# EAGLE design AlimBoard (EAGLE 5.06)
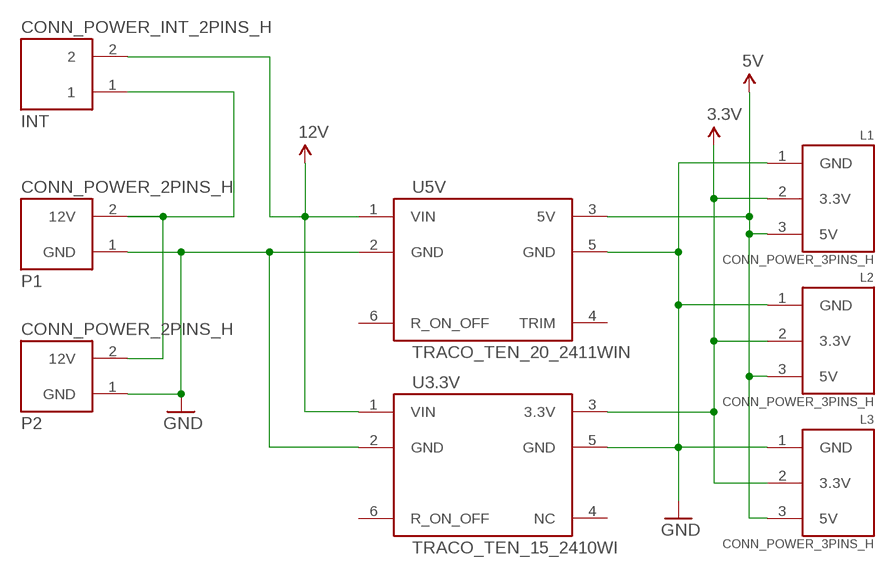
[diagram p0: schematic, sheet 1]

## Parts
INT  CONN_POWER_INT_2PINS_H  [2PINS_5MM_90DEG]
L1  CONN_POWER_3PINS_H  [3PINS_3.81MM_90DEG]
L2  CONN_POWER_3PINS_H  [3PINS_3.81MM_90DEG]
L3  CONN_POWER_3PINS_H  [3PINS_3.81MM_90DEG]
P1  CONN_POWER_2PINS_H  [2PINS_5MM_90DEG]
P2  CONN_POWER_2PINS_H  [2PINS_5MM_90DEG]
U3.3V  TRACO_TEN_15_2410WI  [TRACO_1_PER_2]
U5V  TRACO_TEN_20_2411WIN  [TRACO_1_PER_2]

## Nets
3.3V: L1.2(3.3V) L2.2(3.3V) L3.2(3.3V) U3.3V.3(3.3V)
5V: L1.3(5V) L2.3(5V) L3.3(5V) U5V.3(5V)
12V: INT.2 U3.3V.1(VIN) U5V.1(VIN)
GND: L1.1(GND) L2.1(GND) L3.1(GND) P1.1(GND) P2.1(GND) U3.3V.2(GND) U3.3V.5(GND) U5V.2(GND) U5V.5(GND)
N$1: INT.1 P1.2(12V) P2.2(12V)
Unconnected: U3.3V.4(NC) U3.3V.6(R_ON_OFF) U5V.4(TRIM) U5V.6(R_ON_OFF)

## Library data of the parts
INT = Robot:CONN_POWER_INT_2PINS: CONNECTOR FOR A POWER INTERRUPTER
L1-L3 = Robot:CONN_POWER_3PINS: POWER CONNECTOR for logic boards. Provides 3.3V and 5V.
P1 P2 = Robot:CONN_POWER_2PINS: POWER CONNECTOR for DC/DC converter boards and H-bridge motor controllers.
U3.3V = Robot:TRACO_TEN_15_2410WI: TRACO POWER TEN 15-2410WI DC/DC Converter 15W. Vin: 9-36V, Vout: 3.3V
U5V = Robot:TRACO_TEN_20_2411WIN: TRACO POWER TEN 20-2411WIN DC/DC Converter 20W. Vin: 9-36V, Vout: 5V

## Board
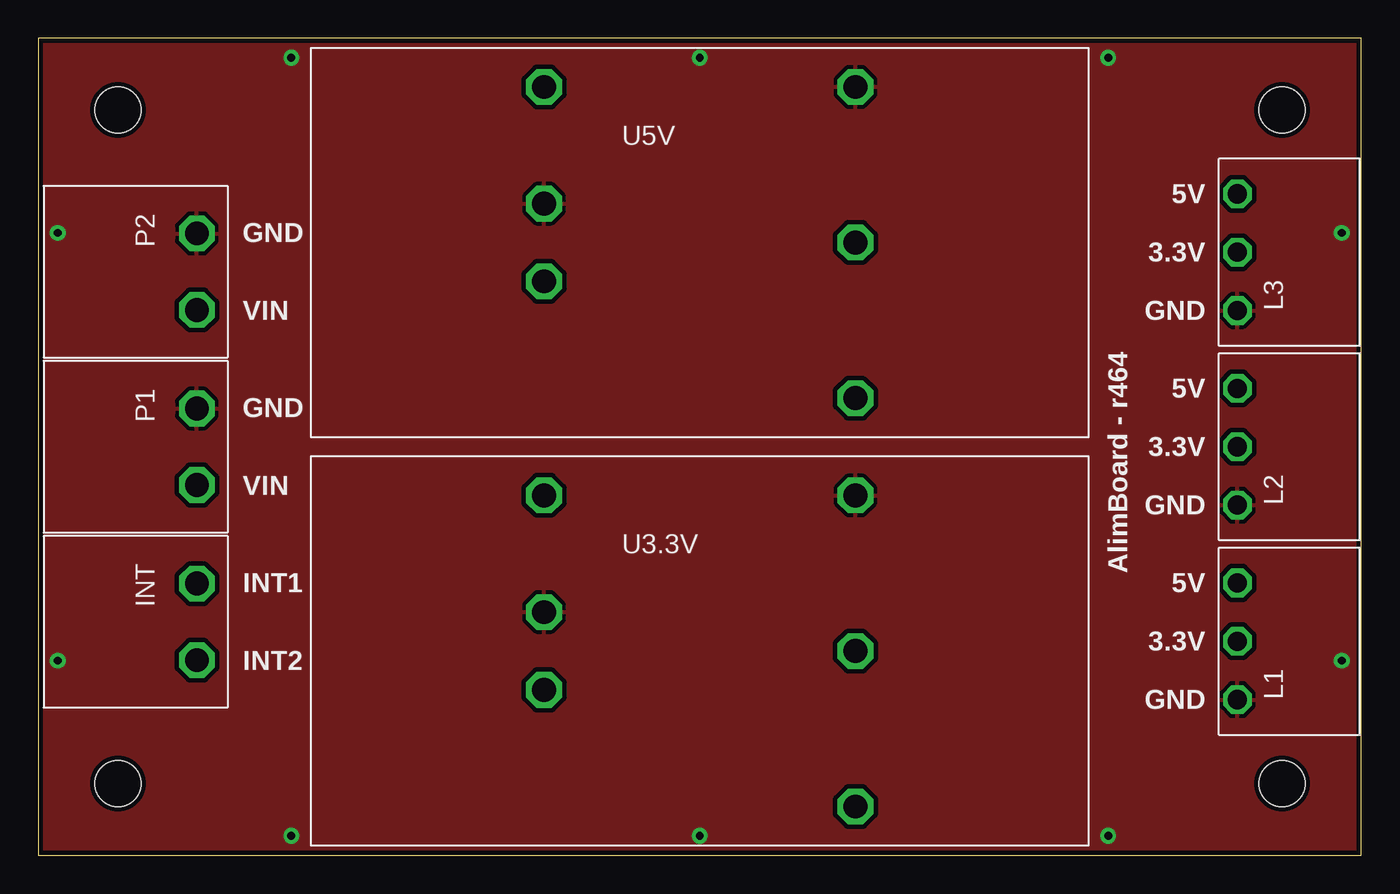
[diagram p1: board, top side]
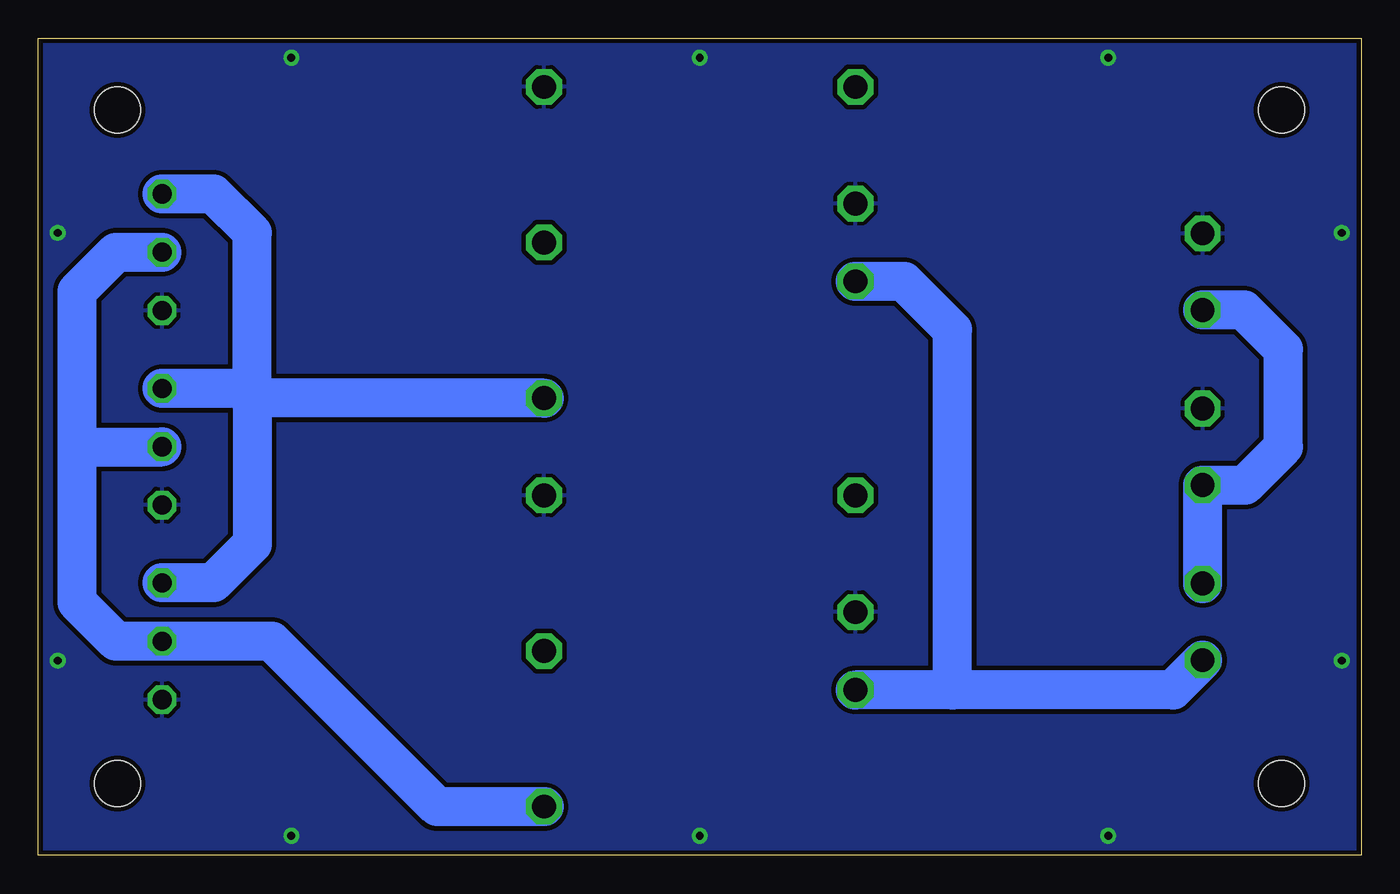
[diagram p2: board, bottom side, seen from below]

Size 86.36 x 53.34 mm. Coordinates in mm from the lower left corner, seen from the top.
Outline: 0,0 86.36,0 86.36,53.34 0,53.34 0,0
Copper layers (1*16): Top 0.035mm / dielectric 1.5mm / Bottom 0.035mm
Design rules "SparkFun": minimum track width 8mil, minimum drill 20mil, track to track 8mil, track to pad 8mil, pad to pad 8mil, via to via 8mil, smd to smd 8mil, copper to edge 10mil, drill to drill 8mil, minimum pad ring 12mil, minimum via ring 10mil, stop-mask expansion 4mil, vias tented up to drill 25mil, thermal gap 10mil
Holes 3 mm at 5.2,48.67 81.2,48.67 81.2,4.67 5.2,4.67

### Footprints (pad centres in the part's own frame; a part is rotated, then mirrored left to right if it is on the bottom)
2PINS_5MM_90DEG = drill 1.55 octagon: 1 -2.5,4; 2 2.5,4
3PINS_3.81MM_90DEG = drill 1.25 octagon: 1 -3.81,3; 2 0,3; 3 3.81,3
TRACO_1_PER_2 = drill 1.55 octagon: 1 -10.16,-2.54; 2 -10.16,2.54; 3 10.16,-10.16; 4 10.16,0; 5 10.16,10.16; 6 -10.16,10.16

### Placement (x,y rotation side)
INT  6.35,15.24 270 top
L1  81.28,13.97 90 top
L2  81.28,26.67 90 top
L3  81.28,39.37 90 top
P1  6.35,26.67 270 top
P2  6.35,38.1 270 top
U3.3V  43.18,13.34 0 top
U5V  43.18,40.01 0 top

### Tracks (layer width: path | path; a pad name or v marks a point on that pad's centre or on a via)
3.3V
  Bottom 2.54: 83.82,26.67 L2.2 | 83.82,26.67 83.82,16.51 81.28,13.97 L1.2 71.12,13.97 60.33,3.17 U3.3V.3 | 83.82,26.67 83.82,36.83 81.28,39.37 L3.2
5V
  Bottom 2.54: L3.3 74.93,43.18 72.39,40.64 72.39,30.48 | L1.3 74.93,17.78 72.39,20.32 72.39,29.21 | 72.39,29.21 72.39,30.48 | 72.39,30.48 L2.3 | U5V.3 71.75,29.84 72.39,29.21
12V
  Bottom 2.54: 26.67,10.79 12.29,10.79 INT.2 | 26.67,10.79 U3.3V.1 | U5V.1 29.84,37.47 26.67,34.29 26.67,10.79
GND  (via drill 0.51)
  other vias: 16.51,52.07 43.18,52.07 69.85,52.07 85.09,40.64 85.09,12.7 69.85,1.27 43.18,1.27 16.51,1.27 1.27,12.7 1.27,40.64
  pour Bottom (isolate 0.305): 0,0 0,53.34 86.36,53.34 86.36,0
  pour Top (isolate 0.305): 0,0 0,53.34 86.36,53.34 86.36,0
N$1
  Bottom 2.54: P2.2 7.66,35.6 5.08,33.02 5.08,26.67 7.58,24.17 P1.2 INT.1

### Text on the board
tPlace: 5V | GND | 3.3V | GND | VIN | 5V | GND | 3.3V | VIN | GND | AlimBoard - r464 | 5V | INT1 | 3.3V | INT2 | GND